# EasyEDA schematic SCH_Creality_k1c_2026-01-29.json
TITLE: Sheet_1; REV: 1.0; Date: 2026-01-28; Sheet: 1/1; Drawn By: axiomless-cyber; Company: Your Company
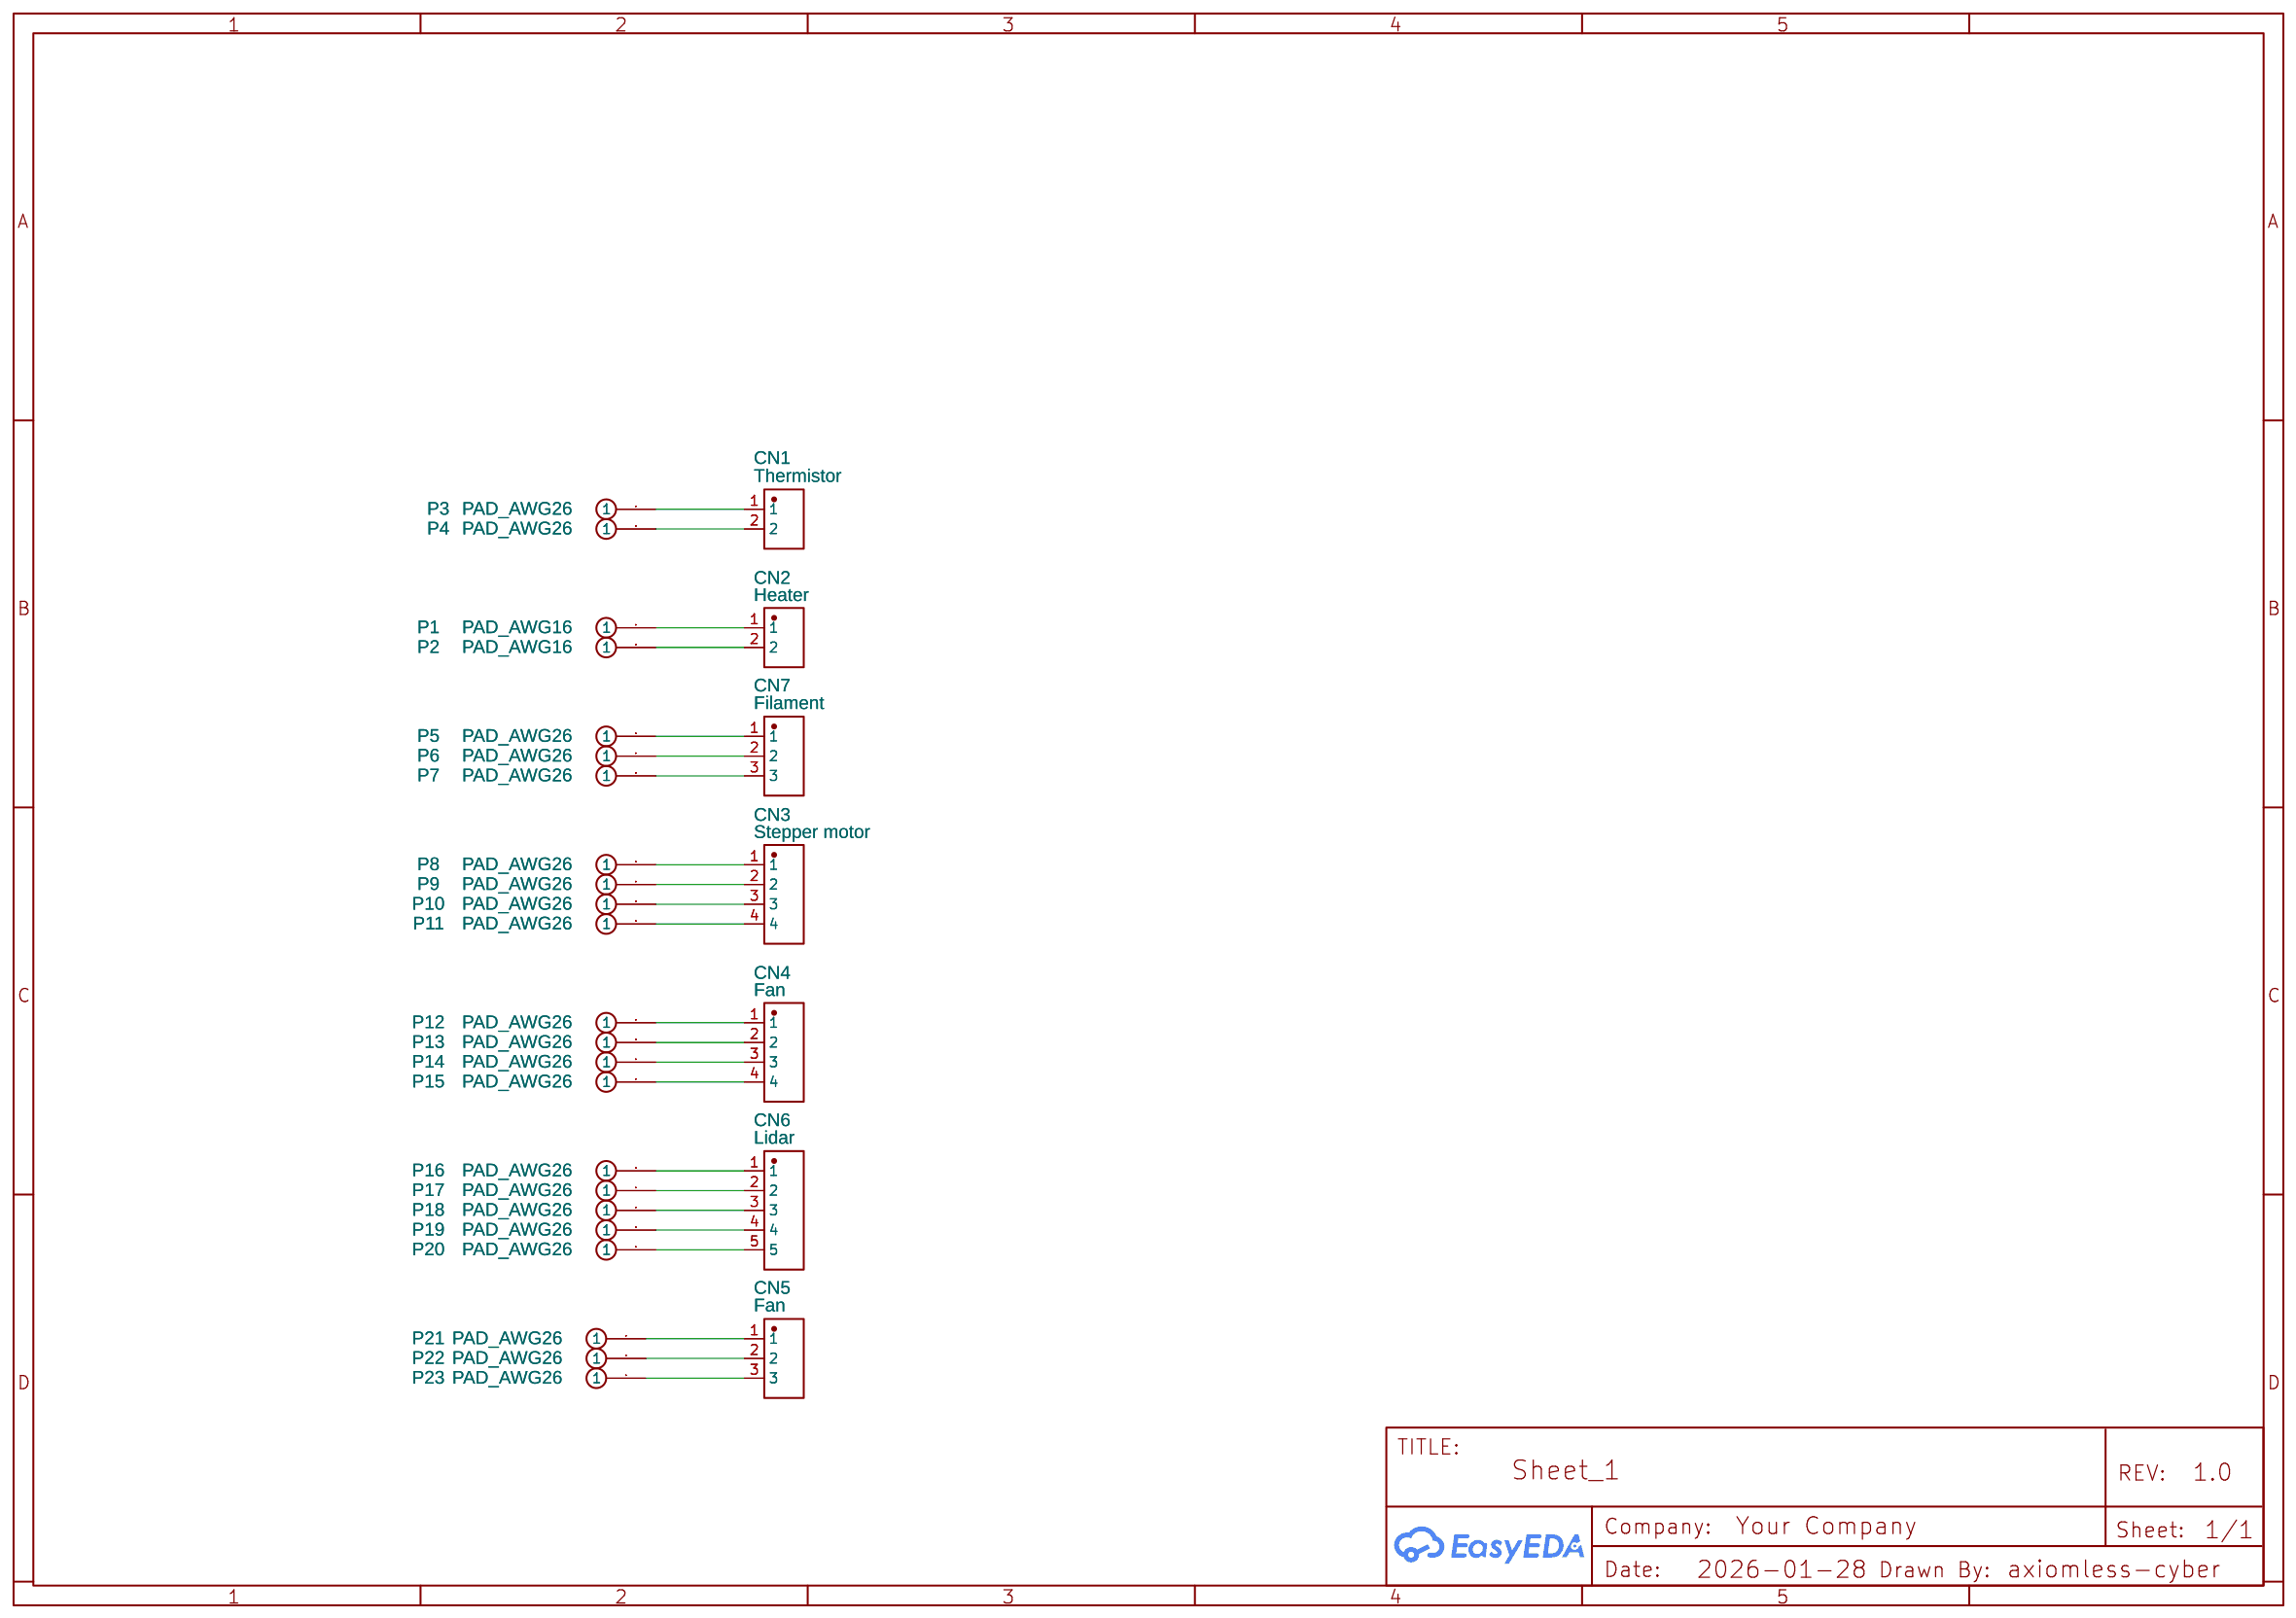
[diagram p0: schematic sheet]

## Parts
CN1  Thermistor  [CONN-TH_WAFER-HY2.0-2PZZ-Y62]
CN2  Heater  [CONN-TH_HX-XHB2.54-2A]
CN3  Stepper motor  [CONN-TH_ZX-MX1.25-4PZZ-Y]
CN4  Fan  [CONN-TH_ZX-MX1.25-4PZZ-Y]
CN5  Fan  [CONN-TH_3P-P1.25_BX-MX1.25-3PWZ-Y]
CN6  Lidar  [CONN-TH_5P-P1.25_ZX-MX1.25-5PWZ-Y]
CN7  Filament  [CONN-TH_3P-P1.25_ZX-MX1.25-3PZZ-Y]
P1  PAD_AWG16  [PAD_AWG16]
P2  PAD_AWG16  [PAD_AWG16]
P3  PAD_AWG26  [PAD_AWG26]
P4  PAD_AWG26  [PAD_AWG26]
P5  PAD_AWG26  [PAD_AWG26]
P6  PAD_AWG26  [PAD_AWG26]
P7  PAD_AWG26  [PAD_AWG26]
P8  PAD_AWG26  [PAD_AWG26]
P9  PAD_AWG26  [PAD_AWG26]
P10  PAD_AWG26  [PAD_AWG26]
P11  PAD_AWG26  [PAD_AWG26]
P12  PAD_AWG26  [PAD_AWG26]
P13  PAD_AWG26  [PAD_AWG26]
P14  PAD_AWG26  [PAD_AWG26]
P15  PAD_AWG26  [PAD_AWG26]
P16  PAD_AWG26  [PAD_AWG26]
P17  PAD_AWG26  [PAD_AWG26]
P18  PAD_AWG26  [PAD_AWG26]
P19  PAD_AWG26  [PAD_AWG26]
P20  PAD_AWG26  [PAD_AWG26]
P21  PAD_AWG26  [PAD_AWG26]
P22  PAD_AWG26  [PAD_AWG26]
P23  PAD_AWG26  [PAD_AWG26]

## Library data of the parts
CN1 = WAFER-HY2.0-2PZZ-Y62: Supplier: LCSC; Supplier Part: C42441175; Manufacturer: XUNPU(讯普); JLCPCB Part Class: Extended Part; Contributor: lcsc
CN2 = HX XHB2.54-2A: Supplier: LCSC; Supplier Part: C36498946; Manufacturer: hanxia(韩下); JLCPCB Part Class: Extended Part; Contributor: lcsc
CN3 CN4 = ZX-MX1.25-4PZZ-Y: Supplier: LCSC; Supplier Part: C22388576; Manufacturer: Megastar(兆星); JLCPCB Part Class: Extended Part; Contributor: lcsc
CN5 = BX-MX1.25-3PWZ-Y: Supplier: LCSC; Supplier Part: C22388444; Manufacturer: Bossie(博锡); JLCPCB Part Class: Extended Part; Contributor: lcsc
CN6 = ZX-MX1.25-5PWZ-Y: Supplier: LCSC; Supplier Part: C22388572; Manufacturer: Megastar(兆星); JLCPCB Part Class: Extended Part; Contributor: lcsc
CN7 = ZX-MX1.25-3PZZ-Y: Supplier: LCSC; Supplier Part: C22388575; Manufacturer: Megastar(兆星); JLCPCB Part Class: Extended Part; Contributor: lcsc
P1 P2 = PAD_AWG16: Contributor: luciuskalo012
P3-P23 = PAD_AWG26: Contributor: luciuskalo012

## Nets
Net-(CN1-1): CN1.1 P3.1
Net-(CN1-2): CN1.2 P4.1
Net-(CN2-1): CN2.1 P1.1
Net-(CN2-2): CN2.2 P2.1
Net-(CN3-1): CN3.1 P8.1
Net-(CN3-2): CN3.2 P9.1
Net-(CN3-3): CN3.3 P10.1
Net-(CN3-4): CN3.4 P11.1
Net-(CN4-1): CN4.1 P12.1
Net-(CN4-2): CN4.2 P13.1
Net-(CN4-3): CN4.3 P14.1
Net-(CN4-4): CN4.4 P15.1
Net-(CN5-1): CN5.1 P21.1
Net-(CN5-2): CN5.2 P22.1
Net-(CN5-3): CN5.3 P23.1
Net-(CN6-1): CN6.1 P16.1
Net-(CN6-2): CN6.2 P17.1
Net-(CN6-3): CN6.3 P18.1
Net-(CN6-4): CN6.4 P19.1
Net-(CN6-5): CN6.5 P20.1
Net-(CN7-1): CN7.1 P5.1
Net-(CN7-2): CN7.2 P6.1
Net-(CN7-3): CN7.3 P7.1
